# EAGLE design mimuz-can-lite-v0.10 (EAGLE 7.7.0)
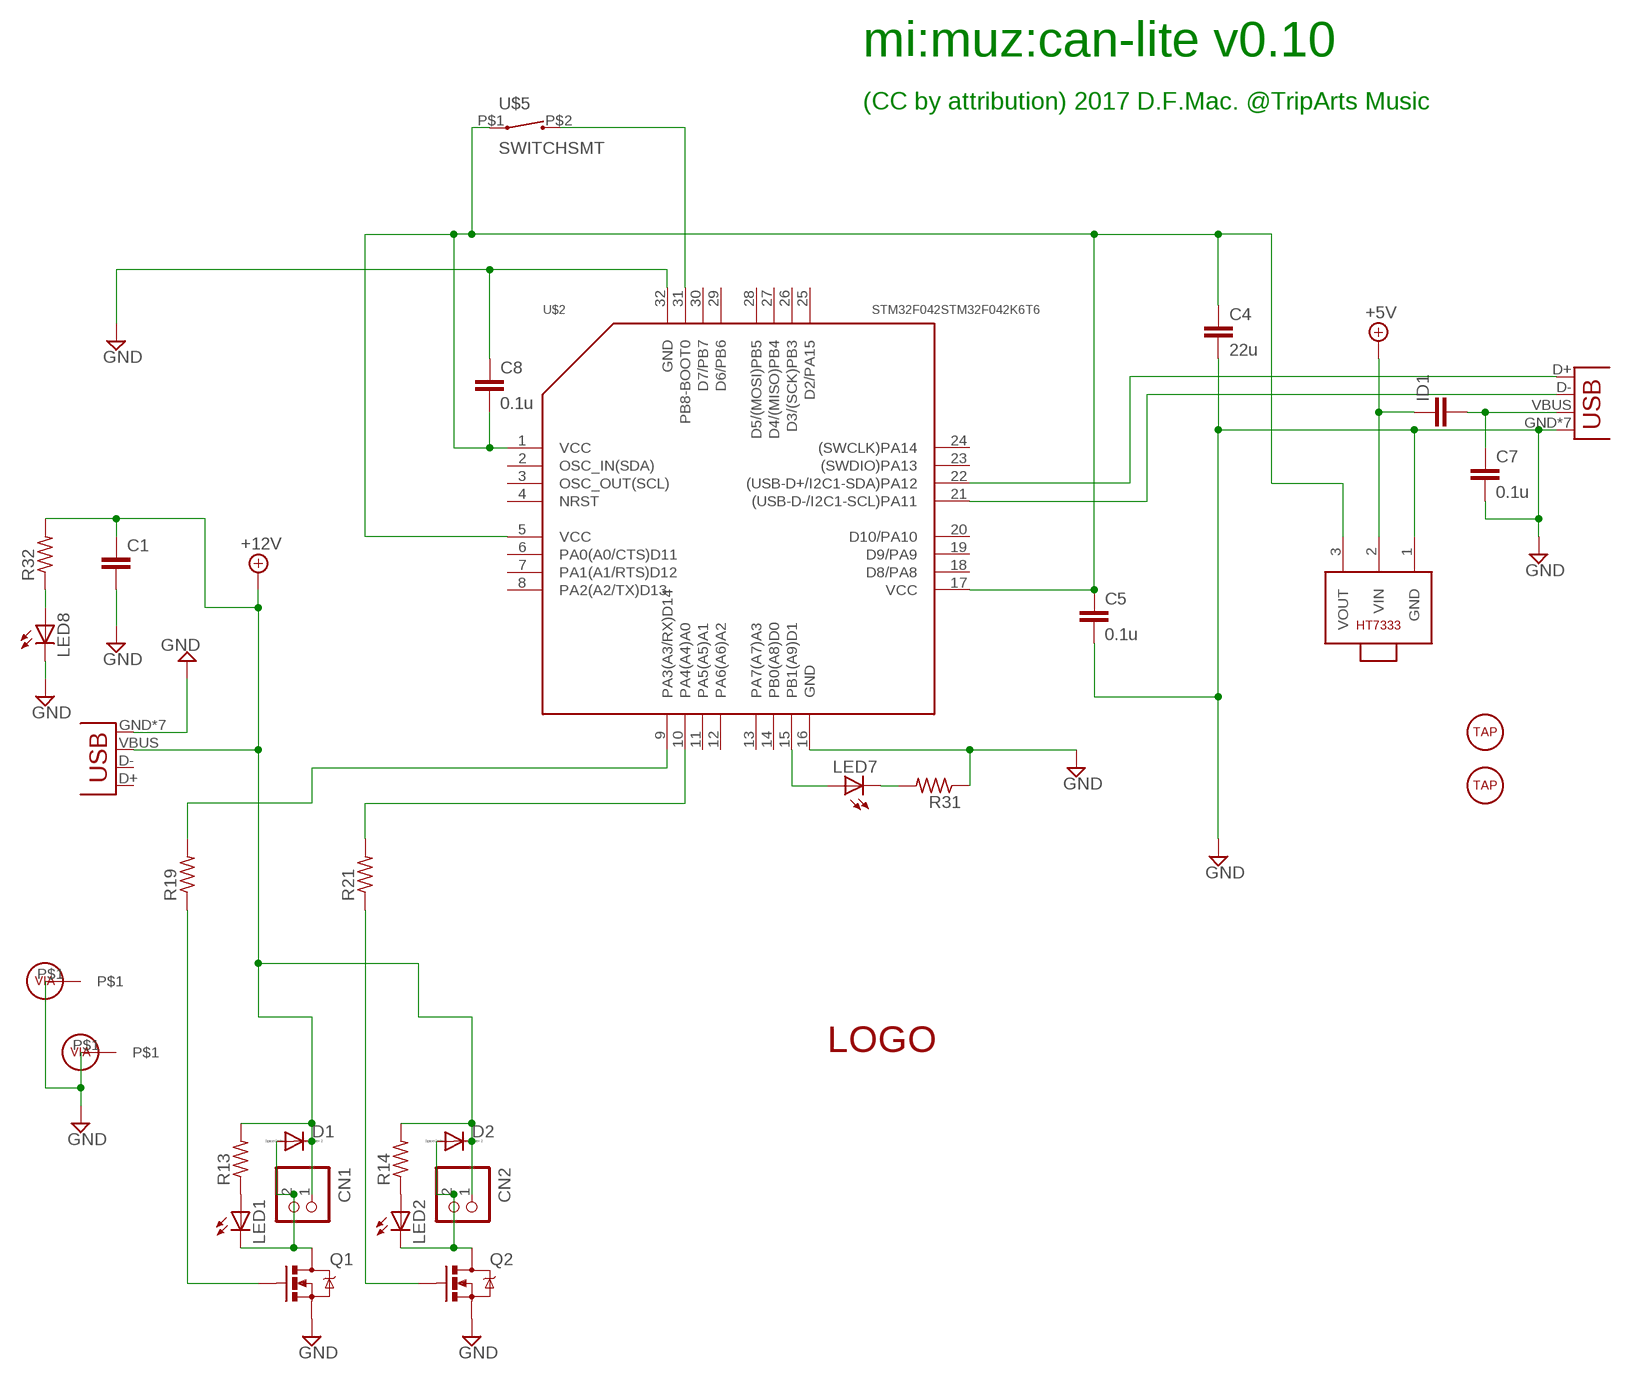
[diagram p0: schematic, sheet 1]

## Parts
C1  C-EUC1206  [C1206]
C4  22u  C-EUC0805  [C0805]
C5  0.1u  C-EUC0603  [C0603]
C7  0.1u  C-EUC0603  [C0603]
C8  0.1u  C-EUC0603  [C0603]
CN1  B2B-PH-K-S  [B2B-PH-K-S]
CN2  B2B-PH-K-S  [B2B-PH-K-S]
D1  DIODE-DO214AC  [DO214AC]
D2  DIODE-DO214AC  [DO214AC]
ID1  C-EUC0805  [C0805]
JP3  USB-MICROB  [USB-MICROB]
JP4  USB-MICROB  [USB-MICROB]
LED1  LED3MM  [LED3MM]
LED2  LED3MM  [LED3MM]
LED7  LED3MM  [LED3MM]
LED8  LED3MM  [LED3MM]
Q1  MOSFET-NCHANNELSMD  [SOT23-3]
Q2  MOSFET-NCHANNELSMD  [SOT23-3]
R13  R-US_R0805  [R0805]
R14  R-US_R0805  [R0805]
R19  R-US_R0603  [R0603]
R21  R-US_R0603  [R0603]
R31  R-US_R0603  [R0603]
R32  R-US_R0805  [R0805]
U$1  LOGOSMALL  [LOGO-SMALL]
U$2  STM32F042STM32F042K6T6  [TQFP32]
U$3  TAPHOLE  [TAPHOLE-3MM]
U$4  VIA  [VIA]
U$5  SWITCHSMT  [SWITCH-SMT-2*4*3]
U$6  TAPHOLE  [TAPHOLE-3MM]
U$7  VIA  [VIA]
U$14  HT7333  [SOT89]

## Nets
3.3V: C4.1 C5.1 C8.2 U$2.1(VCC) U$2.5(VCC) U$2.17(VCC) U$5.P$1 U$14.3(VOUT)
+5V: ID1.1 U$14.2(VIN)
+5V2: C1.1 CN1.1 CN2.1 D1.C D2.C JP3.VBUS R13.2 R14.2 R32.2 ; supply symbol labelled +12V
D+: JP4.D+ U$2.22((USB-D+/I2C1-SDA)PA12)
D-: JP4.D- U$2.21((USB-D-/I2C1-SCL)PA11)
GND [power]: C1.2 C4.2 C5.2 C7.2 C8.1 JP3.GND JP3.MT1(GND) JP3.MT3(GND) JP3.P$2(GND) JP3.P$4(GND) JP3.P$5(GND) JP3.P$6(GND) JP4.GND JP4.MT1(GND) JP4.MT3(GND) JP4.P$2(GND) JP4.P$4(GND) JP4.P$5(GND) JP4.P$6(GND) LED8.K(C) Q1.2(S) Q2.2(S) R31.1 U$2.16(GND) U$2.32(GND) U$4.P$1 U$7.P$1 U$14.1(GND)
N$1: LED7.A U$2.15(PB1(A9)D1)
N$2: LED7.K(C) R31.2
N$7: CN1.2 D1.A LED1.K(C) Q1.3(D)
N$8: CN2.2 D2.A LED2.K(C) Q2.3(D)
N$17: LED1.A R13.1
N$20: LED2.A R14.1
N$23: Q2.1(G) R21.1
N$24: Q1.1(G) R19.1
N$30: U$2.31(PB8-BOOT0) U$5.P$2
N$32: R19.2 U$2.9(PA3(A3/RX)D14)
N$33: R21.2 U$2.10(PA4(A4)A0)
N$44: LED8.A R32.1
VBUS: C7.1 ID1.2 JP4.VBUS
Unconnected: JP3.D+ JP3.D- U$2.2(OSC_IN(SDA)) U$2.3(OSC_OUT(SCL)) U$2.4(NRST) U$2.6(PA0(A0/CTS)D11) U$2.7(PA1(A1/RTS)D12) U$2.8(PA2(A2/TX)D13) U$2.11(PA5(A5)A1) U$2.12(PA6(A6)A2) U$2.13(PA7(A7)A3) U$2.14(PB0(A8)D0) U$2.18(D8/PA8) U$2.19(D9/PA9) U$2.20(D10/PA10) U$2.23((SWDIO)PA13) U$2.24((SWCLK)PA14) U$2.25(D2/PA15) U$2.26(D3/(SCK)PB3) U$2.27(D4/(MISO)PB4) U$2.28(D5/(MOSI)PB5) U$2.29(D6/PB6) U$2.30(D7/PB7)

## Notes on the sheet
- mi:muz:can-lite v0.10
- (CC by attribution) 2017 D.F.Mac. @TripArts Music

## Library data of the parts
C1 C4 C5 C7 C8 ID1 = 0my:C-EU: CAPACITOR, European symbol
CN1 CN2 = jst-ph:B2B-PH-*: Wire-to-Board 2.0mm pitch top mount connector Source: http://www.jst-mfg.com/product/pdf/jpn/PH.pdf http://www.jst-mfg.com/product/detail.php?series=199
D1 D2 = diode:DIODE-: DIODE
JP3 JP4 = 0my:USB: USB Connectors USB-B-PTH is fully proven SKU : PRT-00139/CONN-08278 USB-miniB is fully proven SKU : PRT-00587 USB-A-PCB is untested. USB-A-H is throughly reviewed, but untested. Spark Fun Electronics SKU : PRT-00437 USB-B-SMT is throughly reviewed, but untested. Needs silkscreen touching up. USB-A-S has not been used/tested USB-MB-H has not been used/tested USB-MICROB has been used. CONN-09505; PROD_ID: CONN-09505
LED1 LED2 LED7 LED8 = led:LED: LED OSRAM: - CHIPLED LG R971, LG N971, LY N971, LG Q971, LY Q971, LO R971, LY R971 LH N974, LH R974 LS Q976, LO Q976, LY Q976 LO Q996 - Hyper CHIPLED LW Q18S LB Q993, LB Q99A, LB R99A - SideLED LS A670, LO A670, LY A670, LG A670, LP A670 LB A673, LV A673, LT A673, LW A673 LH A674 LY A675 LS A676, LA A676, LO A676, LY A676, LW A676 LS A679, LY A679, LG A679 - Hyper Micro SIDELED® LS Y876, LA Y876, LO Y876, LY Y876 LT Y87S - SmartLED LW L88C, LW L88S LB L89C, LB L89S, LG L890 LS L89K, LO L89K, LY L89K LS L896, LA L896, LO L896, LY L896 - TOPLED LS T670, LO T670, LY T670, LG T670, LP T670 LSG T670, LSP T670, LSY T670, LOP T670, LYG T670 LG T671, LOG T671, LSG T671 LB T673, LV T673, LT T673, LW T673 LH T674 LS T676, LA T676, LO T676, LY T676, LB T676, LH T676, LSB T676, LW T676 LB T67C, LV T67C, LT T67C, LS T67K, LO T67K, LY T67K, LW E67C LS E67B, LA E67B, LO E67B, LY E67B, LB E67C, LV E67C, LT E67C LW T67C LS T679, LY T679, LG T679 LS T770, LO T770, LY T770, LG T770, LP T770 LB T773, LV T773, LT T773, LW T773 LH T774 LS E675, LA E675, LY E675, LS T675 LS T776, LA T776, LO T776, LY T776, LB T776 LHGB T686 LT T68C, LB T68C - Hyper Mini TOPLED® LB M676 - Mini TOPLED Santana® LG M470 LS M47K, LO M47K, LY M47K Source: http://www.osram.convergy.de LUXEON: - LUMILED® LXK2-PW12-R00, LXK2-PW12-S00, LXK2-PW14-U00, LXK2-PW14-V00 LXK2-PM12-R00, LXK2-PM12-S00, LXK2-PM14-U00 LXK2-PE12-Q00, LXK2-PE12-R00, LXK2-PE12-S00, LXK2-PE14-T00, LXK2-PE14-U00 LXK2-PB12-K00, LXK2-PB12-L00, LXK2-PB12-M00, LXK2-PB14-N00, LXK2-PB14-P00, LXK2-PB14-Q00 LXK2-PR12-L00, LXK2-PR12-M00, LXK2-PR14-Q00, LXK2-PR14-R00 LXK2-PD12-Q00, LXK2-PD12-R00, LXK2-PD12-S00 LXK2-PH12-R00, LXK2-PH12-S00 LXK2-PL12-P00, LXK2-PL12-Q00, LXK2-PL12-R00 Source: www.luxeon.com KINGBRIGHT: KA-3528ASYC Source: www.kingbright.com
Q1 Q2 = 0my:MOSFET-NCHANNEL: Generic NMOS footprint
R13 R14 R19 R21 R31 R32 = 0my:R-US_: RESISTOR, American symbol
U$1 = 0my:LOGO
U$2 = 1my:STM32F042
U$3 U$6 = 0my:TAPHOLE
U$4 U$7 = 0my:VIA
U$5 = 1my:SWITCH
U$14 = 0my:HT7333

## Net classes
0 default: width 0.406 mm, clearance 0.254 mm
1 power: width 0.533 mm, clearance 0.254 mm
2 D+: width 0.305 mm, clearance 0.203 mm
3 D-: width 0.305 mm, clearance 0.203 mm
4 VBUS: width 0.406 mm, clearance 0.203 mm

## Board
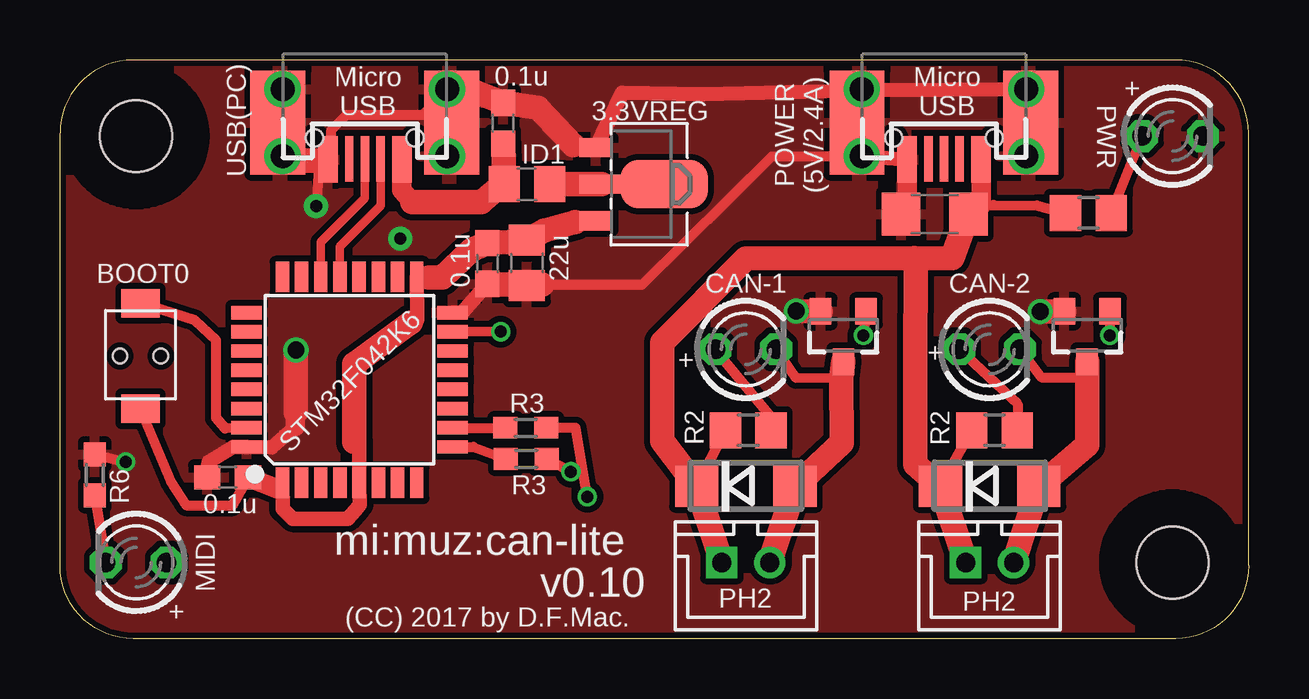
[diagram p1: board, top side]
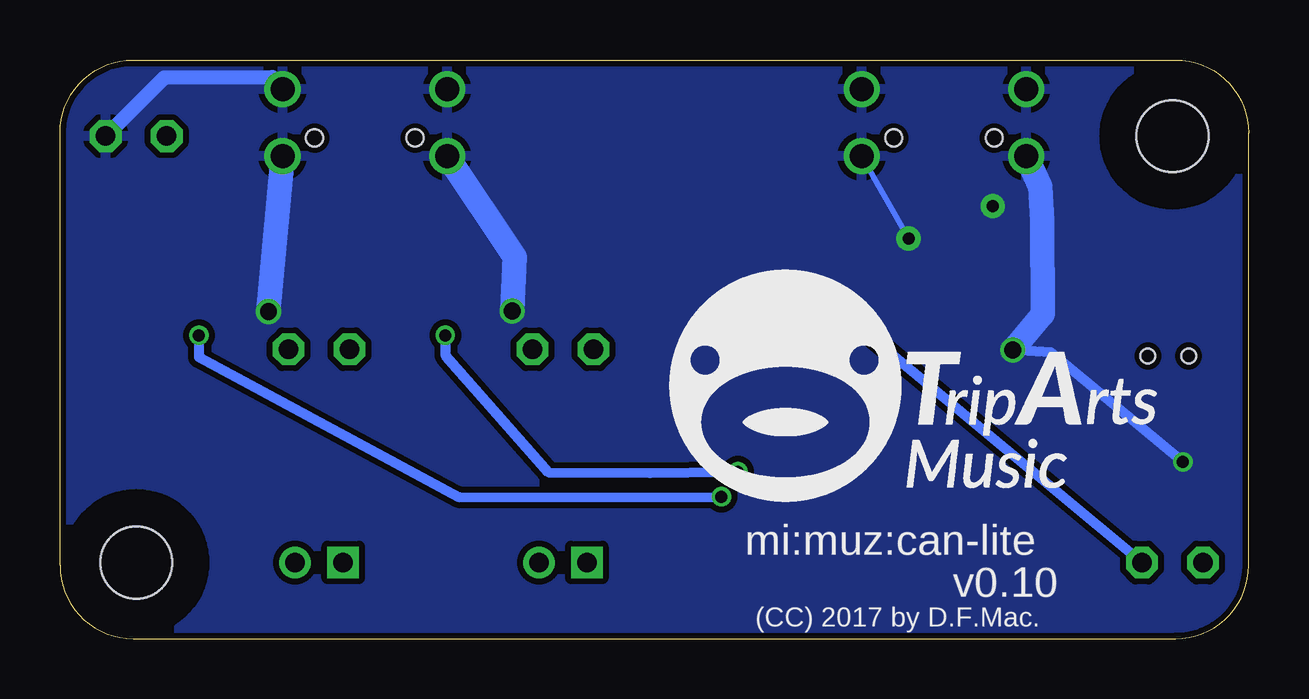
[diagram p2: board, bottom side, seen from below]

Size 49.53 x 24.13 mm. Coordinates in mm from the lower left corner, seen from the top.
Outline: 49.53,3.05 49.53,21.08 arc90 46.48,24.13 3.05,24.13 arc90 0,21.08 0,3.05 arc90 3.05,0 46.48,0 arc90 49.53,3.05
Copper layers (1*16): Top 0.035mm / dielectric 1.5mm / Bottom 0.035mm
Design rules "Elecrow_2-layer_eagle_rule": minimum track width 6mil, minimum drill 12mil, track to track 6mil, track to pad 6mil, pad to pad 6mil, via to via 6mil, smd to smd 0mil, copper to edge 10mil, drill to drill 10mil, minimum pad ring 10mil, minimum via ring 6mil, stop-mask expansion 2mil, vias tented up to drill 100mil, thermal gap 10mil

### Footprints (pad centres in the part's own frame; a part is rotated, then mirrored left to right if it is on the bottom)
C1206 = smd 1.6 x 1.8: 1 -1.4,0; 2 1.4,0
C0805 = smd 1.3 x 1.5: 1 -0.95,0; 2 0.95,0
C0603 = smd 1.1 x 1: 1 -0.85,0; 2 0.85,0
B2B-PH-K-S = drill 0.8 square: 1 -1,0 | drill 0.8: 2 1,0
DO214AC = smd 1.8 x 1.7: A 2.05,0; C -2.05,0
USB-MICROB = smd 0.35 x 1.9: D+ 0,2.904; D- -0.65,2.904; ID 0.65,2.904 | smd 0.813 x 1.93: GND 1.541,2.929; VBUS -1.541,2.929 | smd 2.286 x 4.318: MT1 3.62,1.397; MT3 -3.619,1.397 | drill 1: P$2 -3.429,2.794; P$4 -3.429,0; P$5 3.429,2.794; P$6 3.429,0 | hole 0.7: -2.095,2.032; 2.095,2.032
LED3MM = drill 0.813 octagon: A -1.27,0; K 1.27,0
SOT23-3 = smd 0.9 x 1.1: 1 -0.95,-1; 2 0.95,-1; 3 0,1.1
R0805 = smd 1.3 x 1.5: 1 -0.95,0; 2 0.95,0
R0603 = smd 1 x 0.9: 1 -0.85,0; 2 0.85,0
TQFP32 = smd 1.27 x 0.559: 1 -4.293,2.8; 2 -4.293,2; 3 -4.293,1.2; 4 -4.293,0.4; 5 -4.293,-0.4; 6 -4.293,-1.2; 7 -4.293,-2; 8 -4.293,-2.8; 17 4.293,-2.8; 18 4.293,-2; 19 4.293,-1.2; 20 4.293,-0.4; 21 4.293,0.4; 22 4.293,1.2; 23 4.293,2; 24 4.293,2.8 | smd 0.559 x 1.27: 9 -2.8,-4.293; 10 -2,-4.293; 11 -1.2,-4.293; 12 -0.4,-4.293; 13 0.4,-4.293; 14 1.2,-4.293; 15 2,-4.293; 16 2.8,-4.293; 25 2.8,4.293; 26 2,4.293; 27 1.2,4.293; 28 0.4,4.293; 29 -0.4,4.293; 30 -1.2,4.293; 31 -2,4.293; 32 -2.8,4.293
TAPHOLE-3MM = hole 3: 0,0
VIA = drill 0.5 pad 0.813: P$1 0,0
SWITCH-SMT-2*4*3 = smd 1.2 x 1.6: P$1 2.2,0; P$2 -2.2,0 | hole 0.6: 0,-0.85; 0,0.85
SOT89 = smd 0.8 x 1.4: 1 -1.524,-1.905; 3 1.524,-1.905 | smd 0.8 x 1.9: 2 0,-1.651 | smd 2.032 x 3.65: 4 0,0.94

### Placement (x,y rotation side)
C1  36.45,17.7 180 top
C4  19.46,15.67 270 top
C5  17.81,15.65 270 top
C7  18.47,21.49 90 top
C8  6.99,6.73 0 top
CN1  28.57,3.17 0 top
CN2  38.73,3.17 0 top
D1  28.57,6.35 0 top
D2  38.73,6.35 0 top
ID1  19.46,18.95 180 top
JP3  36.83,22.91 180 top
JP4  12.7,22.91 180 top
LED1  28.57,12.06 0 top
LED2  38.73,12.06 0 top
LED7  3.17,3.17 180 top
LED8  46.35,20.95 0 top
Q1  32.64,12.65 180 top
Q2  42.8,12.65 180 top
R13  28.68,8.69 180 top
R14  38.94,8.69 180 top
R19  19.43,7.49 180 top
R21  19.41,8.79 180 top
R31  1.45,6.83 270 top
R32  42.85,17.75 180 top
U$1  24.13,5.71 0 bottom
U$2  12.06,10.79 90 top
U$3  3.17,20.95 0 top
U$4  10.67,18.03 0 top
U$5  3.35,11.79 270 top
U$6  46.35,3.17 0 top
U$7  14.17,16.69 0 top
U$14  24.23,18.95 270 top

### Tracks (layer width: path | path; a pad name or v marks a point on that pad's centre or on a via)
3.3V
  Top 0.406: U$2.1 9.12,6.22 | U$5.P$1 4.62,6.55 5.26,5.56 7.19,5.56 C8.2
  Top 0.61: 15.37,15.06 U$2.17 14.88,13.31 14.83,13.21 14.61,13.18 | 12.27,8.2 12.47,8.23 U$2.5 12.5,5.59 12.42,5.49 11.99,5 9.7,5 9.27,5.41 U$2.1
  Top 0.813: 9.12,6.22 C8.2 | U$14.3 21.46,17.37
  Top 1.016: 21.46,17.37 20.17,17.02 C4.1 19.51,16.59 C5.1 17.14,16.2 15.93,15.06 15.37,15.06 | 14.61,13.18 12.27,11.46 12.27,8.2
+5V
  Top 0.406: ID1.1 20.52,18.95
  Top 1.016: 20.85,18.97 20.52,18.95 U$14.2
+5V2
  Top 0.406: JP3.VBUS 38.38,18.03 37.82,17.45 38.38,18.09 38.89,18.09 40.72,18.06 R32.2 | 27.3,3.17 CN1.1 | D1.C R13.2 | D2.C R14.2
  Top 0.813: JP3.VBUS 38.38,18.09 C1.1
  Top 1.016: CN1.1 D1.C 25.09,8.26 25.09,12.34 28.57,15.85 35.59,15.88 35.66,15.85 | CN2.1 D2.C 35.64,7.26 35.64,11.3 35.66,15.85 | C1.1 37.19,15.88 35.66,15.85
D+
  Top 0.356: JP4.D+ 12.7,18.36 10.87,16.54 U$2.22
D-
  Top 0.356: JP4.D- arc-90 13.36,20 13.36,18.06 11.66,16.36 U$2.21
GND  (via drill 0.5, 0.7)
  Top 0.406: JP4.P$5 JP4.P$6 | JP4.P$5 9.27,22.99 | JP4.P$5 9.27,19.94 | JP4.P$4 15.11,21.84 11.94,21.84 11.3,21.21 11.3,20.7 11.18,20.45 JP4.GND 10.79,19.94 U$4.P$1 | 19.91,14.76 24.26,14.76 29.67,20.12 JP3.P$5 | 33.66,20.32 JP3.MT1 | R31.1 v2.74,7.37
  Top 0.61: C8.1 6.1,6.73 6.2,7.37 7.21,8 U$2.32 8.81,7.98 9.37,8.46 9.8,8.84 | 21.39,20.57 U$14.1 23.42,22.76 26.8,22.71 33.66,22.86 | JP3.GND JP3.P$5 | JP3.P$5 JP3.P$6 33.66,22.86 | JP3.P$5 33.66,22.86 | 33.02,20.32 33.66,20.32 33.66,22.86 | 33.66,22.86 JP3.P$4 JP3.P$2 40.64,20.95 JP3.MT3 | U$2.16 16.76,13.59 C5.2
  Top 0.813: JP3.GND 35.31,18.14 C1.2 | 9.8,8.84 9.83,9.42
  Top 1.016: 9.27,19.94 10.79,19.94 | JP4.P$2 JP4.P$4 | JP4.MT3 JP4.P$4 | JP4.P$4 17.27,22.81 C7.2 19.91,22.15 21.39,20.57 | Q1.2 v30.68,13.66 | Q2.2 v40.84,13.64 | 19.91,14.76 C5.2 C4.2 20.09,14.76 | 9.83,9.42 v9.83,12.04
  Bottom 0.254: U$7.P$1 JP4.P$2
  Bottom 0.406: v2.74,7.37 8.26,11.94 v9.83,12.04
  Bottom 0.61: LED8.K 45.19,23.39 40.69,23.42 JP3.P$4
  Bottom 1.016: JP4.P$5 8.69,18.85 8.61,17.42 8.59,13.54 v9.83,12.04 | v30.68,13.66 30.58,15.91 JP3.P$5 | v40.84,13.64 JP3.P$2
  pour Bottom: -1.27,24.13 50.8,24.13 50.8,0 -1.27,0
  pour Top: -0.64,24.13 50.16,24.13 50.16,0 -0.64,0
N$1  (via drill 0.5)
  Top 0.406: v18.36,12.8 U$2.15
  Bottom 0.406: v18.36,12.8 15.88,12.7 LED7.A
N$2
  Top 0.406: R31.2 LED7.K
N$7
  Top 0.406: LED1.K 30.66,10.87 32.54,10.9
  Top 1.016: CN1.2 D1.A 32.56,8.15 32.54,10.9 Q1.3
N$8
  Top 0.406: LED2.K 40.89,10.9 42.8,10.9
  Top 1.016: CN2.2 D2.A 42.8,8.08 42.8,10.9 Q2.3
N$17
  Top 0.406: R13.1 29.64,9.25 LED1.A
N$20
  Top 0.406: LED2.A 39.9,9.78 R14.1
N$23  (via drill 0.5)
  Top 0.406: Q2.1 v43.74,12.65 | v21.97,5.92 21.49,8.79 R21.1
  Bottom 0.406: v43.74,12.65 43.74,11.73 32.89,5.89 v21.97,5.92
N$24  (via drill 0.5)
  Top 0.406: Q1.1 v33.48,12.65 | v21.29,6.96 R19.1
  Bottom 0.406: v33.48,12.65 33.48,11.81 29.18,6.93 24.94,6.91 21.72,6.96 v21.29,6.96
N$30
  Top 0.406: U$2.31 6.88,8.76 6.5,9.2 6.5,12.45 5.64,13.26 U$5.P$2
N$32
  Top 0.406: U$2.9 17.22,8 R19.2
N$33
  Top 0.406: U$2.10 18.64,8.79 R21.2
N$44
  Top 0.406: R32.1 LED8.A
VBUS
  Top 0.813: 14.68,18.21 14.25,18.69 JP4.VBUS
  Top 1.016: 14.68,18.21 17.55,18.21 18.47,18.97 ID1.2 C7.1

### Text on the board
_tNames: Micro / USB | 0.1u | Micro / USB | + | USB(PC) | 3.3VREG | POWER / (5V/2.4A) | PWR | ID1 | 0.1u | 22u | BOOT0 | CAN-1 | CAN-2 | + | + | STM32F042K6 | R3 | R2 | R2 | R6 | 0.1u | R3 | mi:muz:can-lite | MIDI | v0.10 | PH2 | PH2 | + | (CC) 2017 by D.F.Mac.
_bNames: mi:muz:can-lite | v0.10 | (CC) 2017 by D.F.Mac.